# EAGLE design ATtiny-313 (EAGLE 6.4)
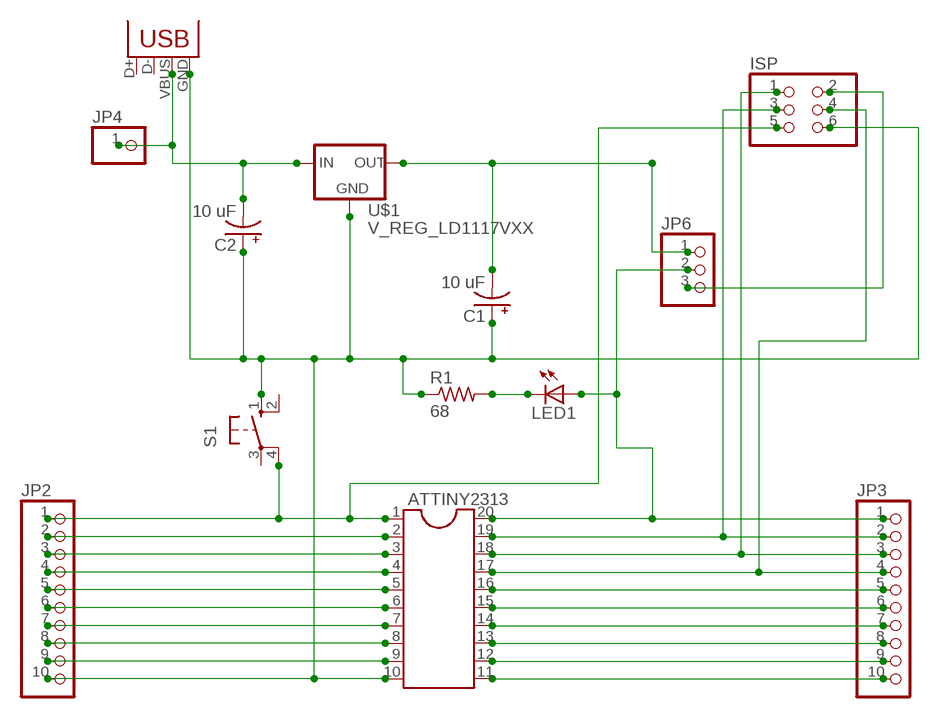
[diagram p0: schematic, sheet 1]

## Parts
ATTINY2313  DIL20S  [SOCKET-20]
C1  10 uF  CPOL-USE1.8-4  [E1,8-4]
C2  10 uF  CPOL-USE1.8-4  [E1,8-4]
ISP  PINHD-2X3  [2X03]
JP1  USB-B  USBPTH  [USB-B-PTH]
JP2  PINHD-1X10  [1X10]
JP3  PINHD-1X10  [1X10]
JP4  PINHD-1X1  [1X01]
JP6  PINHD-1X3  [1X03]
LED1  LED5MM  [LED5MM]
R1  68  R-US_0207/10  [0207/10]
S1  10-XX  [B3F-10XX]
U$1  V_REG_LD1117VXX  [78XXL]

## Nets
ISP: ATTINY2313.18 ISP.1 JP3.3
N$1: C2.- JP1.VBUS JP4.1 U$1.OUT(IN)
N$2: ATTINY2313.20 JP3.1 JP6.2 LED1.A
N$3: ATTINY2313.10 C1.+ C2.+ ISP.6 JP1.GND JP2.10 R1.1 S1.1(S) U$1.IN(GND)
N$4: C1.- JP6.1 U$1.GND(OUT)
N$5: ATTINY2313.1 ISP.5 JP2.1 S1.4(P1)
N$6: ATTINY2313.2 JP2.2
N$7: ATTINY2313.3 JP2.3
N$8: ATTINY2313.4 JP2.4
N$9: ATTINY2313.5 JP2.5
N$10: ATTINY2313.6 JP2.6
N$11: ATTINY2313.7 JP2.7
N$12: ATTINY2313.8 JP2.8
N$13: ATTINY2313.9 JP2.9
N$14: ATTINY2313.19 ISP.3 JP3.2
N$16: ATTINY2313.17 ISP.4 JP3.4
N$17: ATTINY2313.16 JP3.5
N$18: ATTINY2313.15 JP3.6
N$19: ATTINY2313.14 JP3.7
N$20: ATTINY2313.13 JP3.8
N$21: ATTINY2313.12 JP3.9
N$22: ATTINY2313.11 JP3.10
N$23: ISP.2 JP6.3
N$24: LED1.K(C) R1.2
Unconnected: JP1.D+ JP1.D- S1.2(S1) S1.3(P)

## Library data of the parts
ATTINY2313 = ic-package:DIL20: Dual In Line / Socket
C1 C2 = rcl:CPOL-US: POLARIZED CAPACITOR, American symbol
ISP = pinhead:PINHD-2X3: PIN HEADER
JP1 = SparkFun-Connectors:USB: USB Connectors USB-B-PTH is fully proven SKU : PRT-00139/CONN-08278 USB-miniB is fully proven SKU : PRT-00587 USB-A-PCB is untested. USB-A-H is throughly reviewed, but untested. Spark Fun Electronics SKU : PRT-00437 USB-B-SMT is throughly reviewed, but untested. Needs silkscreen touching up. USB-A-S has not been used/tested USB-MB-H has not been used/tested USB-MICROB has been used. CONN-09505; PROD_ID: CONN-08278
JP2 JP3 = pinhead:PINHD-1X10: PIN HEADER
JP4 = pinhead:PINHD-1X1: PIN HEADER
JP6 = pinhead:PINHD-1X3: PIN HEADER
LED1 = SparkFun-LED:LED: LEDs Standard schematic elements and footprints for 5mm, 3mm, 1206, and 0603 sized LEDs. 5mm - Spark Fun Electronics SKU : COM-00529 (and others)
R1 = resistor:R-US_: RESISTOR, American symbol
S1 = switch-omron:10-XX: OMRON SWITCH; MPN: B3F-1000; OC_FARNELL: 176432; OC_NEWARK: 36M3542
U$1 = SparkFun-PowerIC:V_REG_LD1117VXX: LD1117VXX voltage regulator. We carry the 3.3V version (COM-00526) in TO-220 package.

## Board
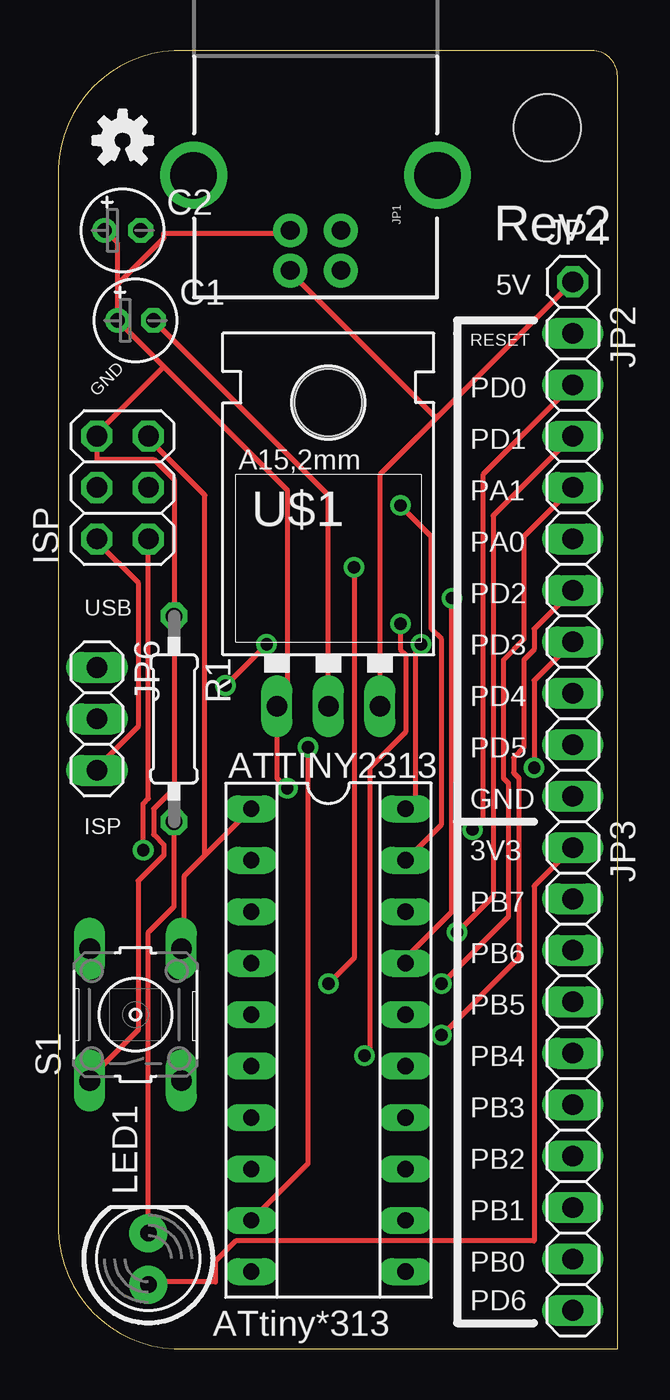
[diagram p1: board, top side]
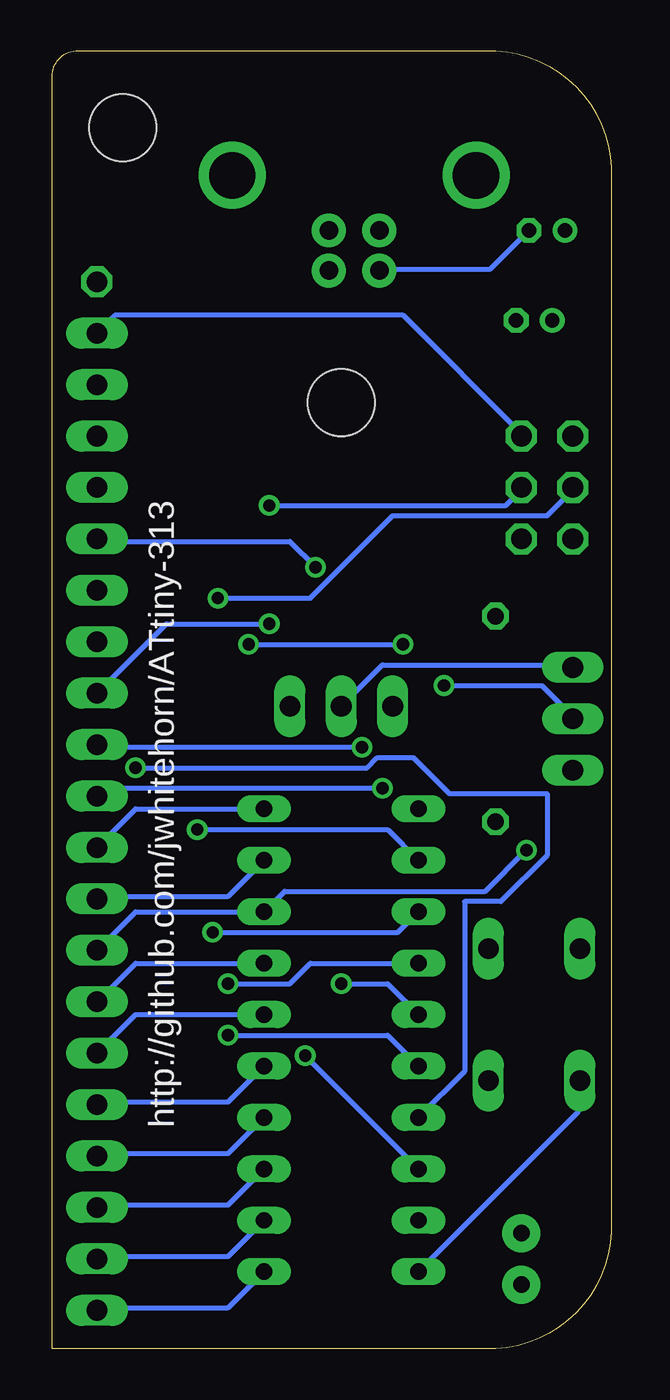
[diagram p2: board, bottom side, seen from below]

Size 27.61 x 64.12 mm. Coordinates in mm from the lower left corner, seen from the top.
Outline: 0,57.77 0,6.35 arc90 5.72,0 27.61,0 27.61,62.85 arc90 26.34,64.12 5.72,64.12 arc90 0,57.77
Copper layers (1*16): Top 0.035mm / dielectric 1.5mm / Bottom 0.035mm
Design rules "default": minimum track width 10mil, minimum drill 24mil, track to track 8mil, track to pad 8mil, pad to pad 8mil, via to via 8mil, smd to smd 8mil, copper to edge 40mil, drill to drill 8mil, minimum pad ring 10mil, minimum via ring 8mil, stop-mask expansion 4mil, vias tented up to drill 0mil, thermal gap 10mil

### Footprints (pad centres in the part's own frame; a part is rotated, then mirrored left to right if it is on the bottom)
SOCKET-20 = drill 0.813 long: 1 -11.43,-3.81; 2 -8.89,-3.81; 3 -6.35,-3.81; 4 -3.81,-3.81; 5 -1.27,-3.81; 6 1.27,-3.81; 7 3.81,-3.81; 8 6.35,-3.81; 9 8.89,-3.81; 10 11.43,-3.81; 11 11.43,3.81; 12 8.89,3.81; 13 6.35,3.81; 14 3.81,3.81; 15 1.27,3.81; 16 -1.27,3.81; 17 -3.81,3.81; 18 -6.35,3.81; 19 -8.89,3.81; 20 -11.43,3.81
E1,8-4 = drill 0.711 pad 1.168: + -0.889,0 | drill 0.711 pad 1.168 octagon: - 0.889,0
2X03 = drill 1.016 octagon: 1 -2.54,-1.27; 2 -2.54,1.27; 3 0,-1.27; 4 0,1.27; 5 2.54,-1.27; 6 2.54,1.27
USB-B-PTH = drill 0.914 pad 1.676: D+ 0,1.25; D- 1.981,1.25; GND 0,-1.25; VBUS 1.981,-1.25 | drill 2.286: S1 -2.718,-6.02; S2 -2.718,6.02
1X10 = drill 1.016 long: 1 -11.43,0; 2 -8.89,0; 3 -6.35,0; 4 -3.81,0; 5 -1.27,0; 6 1.27,0; 7 3.81,0; 8 6.35,0; 9 8.89,0; 10 11.43,0
1X01 = drill 1.016 octagon: 1 0,0
1X03 = drill 1.016 long: 1 -2.54,0; 2 0,0; 3 2.54,0
LED5MM = drill 0.813 pad 1.88: A -1.27,0; K 1.27,0
0207/10 = drill 0.813 octagon: 1 -5.08,0; 2 5.08,0
B3F-10XX = drill 1.016 long: 1 -3.251,2.261; 2 3.251,2.261; 3 -3.251,-2.261; 4 3.251,-2.261
78XXL = drill 1.016 long: GND 0,-3.81; IN -2.54,-3.81; OUT 2.54,-3.81 | hole 3.302: 0,11.176
STAND-OFF = hole 3.302: 0,0

### Placement (x,y rotation side)
ATTINY2313  13.34,15.24 270 top
C1  3.81,50.8 0 top
C2  3.18,55.25 0 top
ISP  3.18,42.55 90 top
JP1  12.7,55.25 270 top
JP2  25.4,38.73 270 top
JP3  25.4,13.33 270 top
JP4  25.4,52.71 0 top
JP6  1.91,31.11 270 top
LED1  4.45,4.44 90 top
R1  5.72,31.11 270 top
S1  3.81,16.51 90 top
U$1  13.34,35.56 0 top
U$2  [STAND-OFF]  24.13,60.32 0 top
U$3  [OSHW-LOGO-S]  3.18,59.69 0 top

### Tracks (layer width: path | path; a pad name or v marks a point on that pad's centre or on a via)
ISP  (via drill 0.61)
  Top 0.254: v4.19,24.64 4.19,26.92 4.45,27.18 4.45,39.88 ISP.1
  Bottom 0.254: JP3.3 25.28,19.81 23.5,21.59 ATTINY2313.18 16.13,22.61 6.23,22.61 v4.19,24.64
N$1
  Top 0.254: U$1.OUT 15.88,43.18 18.67,45.97 | 18.67,45.97 25.28,52.58 JP4.1 | 18.67,45.97 11.56,53.09 JP1.VBUS
  Bottom 0.254: C2.- 4.19,55.12 5.97,53.34 11.31,53.34 JP1.VBUS
N$2  (via drill 0.61)
  Top 0.254: v10.29,34.8 v8.26,32.77 | v17.91,34.8 17.66,34.54 17.66,27.18 ATTINY2313.20 | LED1.A 4.45,3.3 7.75,3.3 7.75,4.32 8.77,5.33 23.5,5.33 23.5,22.86 25.28,24.64 JP3.1
  Bottom 0.254: ATTINY2313.20 23.5,26.67 25.28,24.89 JP3.1 | v8.26,32.77 3.43,32.77 1.91,31.24 JP6.2 | v17.91,34.8 v10.29,34.8
N$3  (via drill 0.61)
  Top 0.254: 2.92,52.58 C1.+ 5.21,48.51 | 2.92,52.58 2.92,54.61 2.42,55.12 C2.+ | 5.21,48.51 11.31,42.42 11.31,32.26 U$1.IN 10.8,28.19 v11.31,27.69 | 2.92,52.58 5.21,54.86 5.21,55.12 11.31,55.12 JP1.GND | 5.21,48.51 1.91,45.21 ISP.6 1.91,44.96 1.91,43.94 4.7,43.94 5.72,42.93 5.72,36.32 R1.1 5.72,36.07 5.72,27.69 4.7,26.67 4.7,25.4 5.21,24.89 5.21,24.38 3.94,23.11 3.94,15.75 1.65,13.46 S1.1
  Bottom 0.254: ATTINY2313.10 1.65,11.68 1.65,13.21 S1.1 | v11.31,27.69 25.02,27.69 25.28,27.43 JP2.10
N$4
  Top 0.254: C1.- 13.34,42.16 U$1.GND
  Bottom 0.254: U$1.GND 11.31,33.78 1.91,33.78 JP6.1
N$5
  Top 0.254: 7.24,24.38 6.23,23.37 6.23,19.81 S1.4 | 7.24,24.38 ATTINY2313.1 | 7.24,24.38 7.24,42.16 4.45,44.96 ISP.5
  Bottom 0.254: JP2.1 25.28,50.29 24.51,51.05 10.29,51.05 4.45,45.21 ISP.5
N$6  (via drill 0.61)
  Top 0.254: v20.45,25.65 20.96,26.16 20.96,43.18 25.28,47.5 JP2.2
  Bottom 0.254: ATTINY2313.2 11.05,25.65 v20.45,25.65
N$7  (via drill 0.61)
  Top 0.254: v19.69,20.57 21.47,22.35 21.47,41.15 25.28,44.96 JP2.3
  Bottom 0.254: ATTINY2313.3 10.54,20.57 v19.69,20.57
N$8  (via drill 0.61)
  Top 0.254: v18.93,18.03 22.23,21.34 22.23,27.94 21.97,28.19 21.97,34.04 22.99,35.05 22.99,40.13 25.28,42.42 JP2.4
  Bottom 0.254: ATTINY2313.4 14.86,19.05 15.88,18.03 v18.93,18.03
N$9  (via drill 0.61)
  Top 0.254: v13.34,18.03 14.61,19.3 v14.61,38.61
  Bottom 0.254: ATTINY2313.5 11.05,18.03 v13.34,18.03 | v14.61,38.61 15.88,39.88 25.28,39.88 JP2.5
N$10  (via drill 0.61)
  Top 0.254: v18.93,15.49 22.74,19.3 22.74,28.19 22.48,28.45 22.48,29.21 22.99,29.72 22.99,34.04 23.5,34.54 23.5,35.56 25.28,37.34 JP2.6
  Bottom 0.254: ATTINY2313.6 11.05,15.49 v18.93,15.49
N$11  (via drill 0.61)
  Top 0.254: v23.5,28.7 23.5,33.02 25.28,34.8 JP2.7
  Bottom 0.254: ATTINY2313.7 7.24,13.72 7.24,22.1 5.46,22.1 3.18,24.38 3.18,27.43 8,27.43 9.78,29.21 11.56,29.21 12.07,28.7 v23.5,28.7
N$12  (via drill 0.61)
  Top 0.254: v15.12,14.48 15.37,14.73 15.37,28.7 17.15,30.48 17.15,34.29 16.89,34.54 v16.89,35.81
  Bottom 0.254: v15.12,14.48 ATTINY2313.8 | v16.89,35.81 21.97,35.81 25.28,32.51 JP2.8
N$13  (via drill 0.61)
  Top 0.254: ATTINY2313.9 12.32,9.14 v12.32,29.72
  Bottom 0.254: v12.32,29.72 25.28,29.72 JP2.9
N$14  (via drill 0.61)
  Top 0.254: v16.89,41.66 18.42,40.13 18.42,35.56 18.93,35.05 18.93,25.91 ATTINY2313.19
  Bottom 0.254: ATTINY2313.19 18.93,22.35 25.28,22.35 JP3.2 | v16.89,41.66 5.21,41.66 4.45,42.42 ISP.3
N$16  (via drill 0.61)
  Top 0.254: v19.43,37.08 19.43,21.59 17.15,19.3 ATTINY2313.17
  Bottom 0.254: ATTINY2313.17 23.5,19.05 25.28,17.27 JP3.4 | v19.43,37.08 14.86,37.08 10.8,41.15 3.18,41.15 1.91,42.42 ISP.4
N$17
  Bottom 0.254: ATTINY2313.16 23.5,16.51 25.28,14.73 JP3.5
N$18
  Bottom 0.254: ATTINY2313.15 18.93,12.19 25.28,12.19 JP3.6
N$19
  Bottom 0.254: ATTINY2313.14 18.93,9.65 25.28,9.65 JP3.7
N$20
  Bottom 0.254: ATTINY2313.13 18.93,7.11 25.28,7.11 JP3.8
N$21
  Bottom 0.254: ATTINY2313.12 18.93,4.57 25.28,4.57 JP3.9
N$22
  Bottom 0.254: ATTINY2313.11 18.93,2.03 25.28,2.03 JP3.10
N$23
  Top 0.254: JP6.3 1.91,28.7 3.94,30.73 3.94,37.85 1.91,39.88 ISP.2
N$24
  Top 0.254: R1.2 5.72,25.91 5.72,21.84 4.45,20.57 4.45,5.84 LED1.K

### Text on the board
tPlace: Rev2 | 5V | RESET | GND | PD0 | PD1 | PA1 | PA0 | USB | PD2 | PD3 | PD4 | PD5 | GND | ISP | 3V3 | PB7 | PB6 | PB5 | PB4 | PB3 | PB2 | PB1 | PB0 | PD6 | ATtiny*313
bPlace: http://github.com/jwhitehorn/ATtiny-313